# Altium schematic sheet Sheet3.SchDoc
size A4
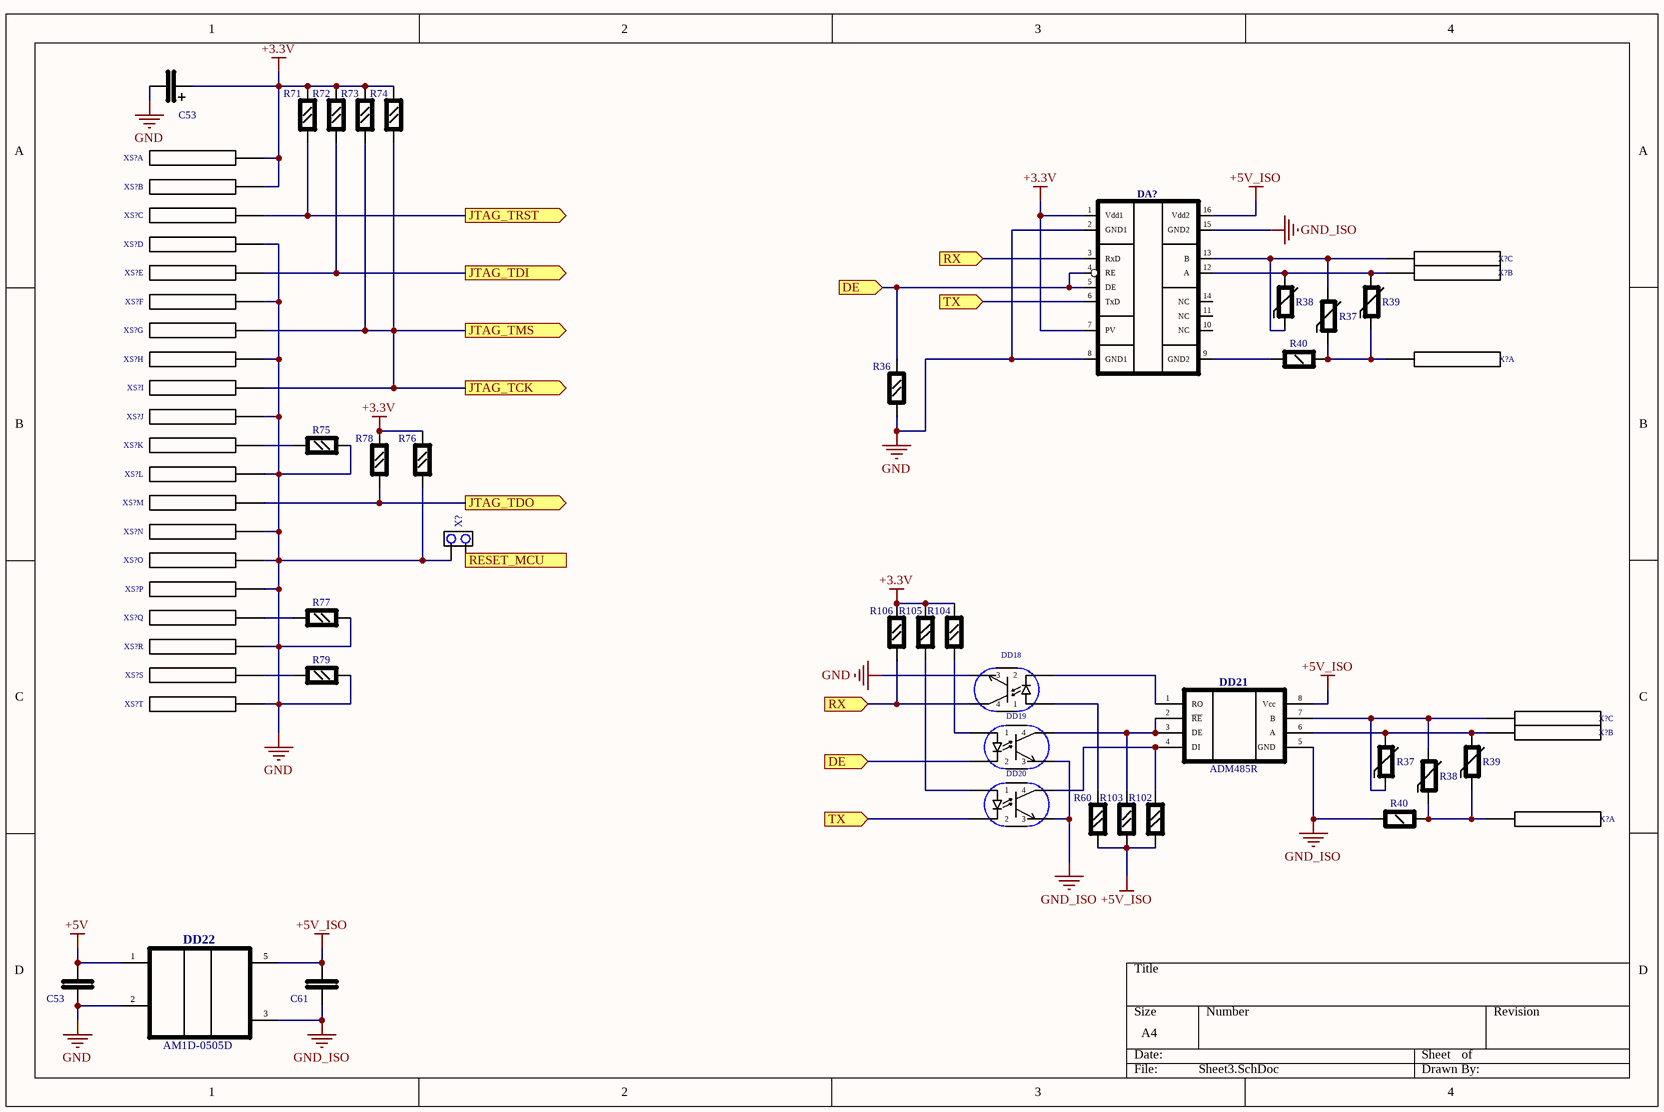
[diagram p0: Sheet3.SchDoc]

## Parts
(Parts that share a designator on the sheet are numbered #1, #2 ... from top to bottom, then left to right.)
C53#1  CAP10  [CAP10]  (value not drawn)
C53#2  C_GORIZONT  [CAPCHIP]  (value not drawn)
C61  C_GORIZONT  [CAPCHIP]  (value not drawn)
DA?  ADM2483  [SO16]  (value not drawn)
DD18  FODM2705  [FODM2705_FODM2705(Primary)]  (value not drawn)
DD19  FODM2705  [FODM2705_FODM2705(Primary)]  (value not drawn)
DD20  FODM2705  [FODM2705_FODM2705(Primary)]  (value not drawn)
DD21  ADM485R  [SO8]
DD22  AM1D-0505D  [P10CU-0512Z]
R36  RES_0805  [RES_0805]  (value not drawn)
R37#1  VARISTOR  [VARISTOR]  (value not drawn)
R37#2  VARISTOR  [VARISTOR]  (value not drawn)
R38#1  VARISTOR  [VARISTOR]  (value not drawn)
R38#2  VARISTOR  [VARISTOR]  (value not drawn)
R39#1  VARISTOR  [VARISTOR]  (value not drawn)
R39#2  VARISTOR  [VARISTOR]  (value not drawn)
R40#1  RES_1206  [RES_1206]  (value not drawn)
R40#2  RES_1206  [RES_1206]  (value not drawn)
R60  RES_0805  [RES_0805]  (value not drawn)
R71  RES_0805  [RES_0805]  (value not drawn)
R72  RES_0805  [RES_0805]  (value not drawn)
R73  RES_0805  [RES_0805]  (value not drawn)
R74  RES_0805  [RES_0805]  (value not drawn)
R75  RES_0805  [RES_0805]  (value not drawn)
R76  RES_0805  [RES_0805]  (value not drawn)
R77  RES_0805  [RES_0805]  (value not drawn)
R78  RES_0805  [RES_0805]  (value not drawn)
R79  RES_0805  [RES_0805]  (value not drawn)
R102  RES_0805  [RES_0805]  (value not drawn)
R103  RES_0805  [RES_0805]  (value not drawn)
R104  RES_0805  [RES_0805]  (value not drawn)
R105  RES_0805  [RES_0805]  (value not drawn)
R106  RES_0805  [RES_0805]  (value not drawn)
X?#1  DFK-MSTBA2.5/3-GF-5.08  [DFK_MSTBA3_ALL]  (value not drawn)  (part C of 3)
X?#2  DFK-MSTBA2.5/3-GF-5.08  [DFK_MSTBA3_ALL]  (value not drawn)  (part B of 3)
X?#3  DFK-MSTBA2.5/3-GF-5.08  [DFK_MSTBA3_ALL]  (value not drawn)  (part A of 3)
X?#4  JL2  [JL2]  (value not drawn)
X?#5  DFK-MSTBA2.5/3-GF-5.08  [DFK_MSTBA3_ALL]  (value not drawn)  (part C of 3)
X?#6  DFK-MSTBA2.5/3-GF-5.08  [DFK_MSTBA3_ALL]  (value not drawn)  (part B of 3)
X?#7  DFK-MSTBA2.5/3-GF-5.08  [DFK_MSTBA3_ALL]  (value not drawn)  (part A of 3)
XS?#1  BH20  [BH20]  (value not drawn)  (part A of 20)
XS?#2  BH20  [BH20]  (value not drawn)  (part B of 20)
XS?#3  BH20  [BH20]  (value not drawn)  (part C of 20)
XS?#4  BH20  [BH20]  (value not drawn)  (part D of 20)
XS?#5  BH20  [BH20]  (value not drawn)  (part E of 20)
XS?#6  BH20  [BH20]  (value not drawn)  (part F of 20)
XS?#7  BH20  [BH20]  (value not drawn)  (part G of 20)
XS?#8  BH20  [BH20]  (value not drawn)  (part H of 20)
XS?#9  BH20  [BH20]  (value not drawn)  (part I of 20)
XS?#10  BH20  [BH20]  (value not drawn)  (part J of 20)
XS?#11  BH20  [BH20]  (value not drawn)  (part K of 20)
XS?#12  BH20  [BH20]  (value not drawn)  (part L of 20)
XS?#13  BH20  [BH20]  (value not drawn)  (part M of 20)
XS?#14  BH20  [BH20]  (value not drawn)  (part N of 20)
XS?#15  BH20  [BH20]  (value not drawn)  (part O of 20)
XS?#16  BH20  [BH20]  (value not drawn)  (part P of 20)
XS?#17  BH20  [BH20]  (value not drawn)  (part Q of 20)
XS?#18  BH20  [BH20]  (value not drawn)  (part R of 20)
XS?#19  BH20  [BH20]  (value not drawn)  (part S of 20)
XS?#20  BH20  [BH20]  (value not drawn)  (part T of 20)

## Ports
DE (in), JTAG_TCK (out), JTAG_TDI (out), JTAG_TDO (out), JTAG_TMS (out), JTAG_TRST (out), RESET_MCU (out), RX (in), TX (in)

## Nets
+3.3V: C53#1.1(D1) DA?.1(Vdd1) DA?.7(PV) R71.2(D2) R72.2(D2) R73.2(D2) R74.2(D2) R76.2(D2) R78.2(D2) R104.2(D2) R105.2(D2) R106.2(D2) XS?#1.1 XS?#2.2
+5V: C53#2.1(D1) DD22.1(+5in)
+5V_ISO: C61.1(D1) DA?.16(Vdd2) DD21.8(Vcc) DD22.5(+12V) R60.1(D1) R102.1(D1) R103.1(D1)
GND: C53#1.2(D2) C53#2.2(D2) DA?.2(GND1) DA?.8(GND1) DD18.Emitter(3) DD22.2(-5in) R36.1(D1) R75.2(D2) R76.1(D1) R77.2(D2) R79.2(D2) X?#4.2 XS?#4.4 XS?#6.6 XS?#8.8 XS?#10.10 XS?#12.12 XS?#14.14 XS?#15.15 XS?#16.16 XS?#18.18 XS?#20.20
GND_ISO: C61.2(D2) DA?.15(GND2) DD19.Emitter(3) DD20.Emitter(3) DD21.5(GND) DD22.3(-12V) R40#2.1(D1)
DE: DA?.4(RE) DA?.5(DE) DD19.Cathod(2) R36.2(D2) ; port DE
JTAG_TCK: R73.1(D1) R74.1(D1) XS?#7.7 XS?#9.9 ; port JTAG_TMS, port JTAG_TCK
JTAG_TDI: R72.1(D1) XS?#5.5 ; port JTAG_TDI
JTAG_TDO: R78.1(D1) XS?#13.13 ; port JTAG_TDO
JTAG_TRST: R71.1(D1) XS?#3.3 ; port JTAG_TRST
RESET_MCU: X?#4.1 ; port RESET_MCU
RX: DA?.3(RxD) DD18.Collector(4) R106.1(D1) ; port RX
TX: DA?.6(TxD) DD20.Cathod(2) ; port TX
NetDA?_9: DA?.9(GND2) R40#1.1(D1)
NetDA?_12: DA?.12(A) R38#1.2(D2) R39#1.2(D2) X?#2.2
NetDA?_13: DA?.13(B) R37#1.2(D2) R38#1.1(D1) X?#1.3
NetDD18_Anod: DD18.Anod(1) R60.2(D2)
NetDD18_Cathod: DD18.Cathod(2) DD21.1(RO)
NetDD19_Anod: DD19.Anod(1) R104.1(D1)
NetDD19_Collector: DD19.Collector(4) DD21.2(~{RE}) DD21.3(DE) R103.2(D2)
NetDD20_Anod: DD20.Anod(1) R105.1(D1)
NetDD20_Collector: DD20.Collector(4) DD21.4(DI) R102.2(D2)
NetDD21_6: DD21.6(A) R37#2.2(D2) R39#2.2(D2) X?#6.2
NetDD21_7: DD21.7(B) R37#2.1(D1) R38#2.2(D2) X?#5.3
NetR37#1_1: R37#1.1(D1) R39#1.1(D1) R40#1.2(D2) X?#3.1
NetR38#2_1: R38#2.1(D1) R39#2.1(D1) R40#2.2(D2) X?#7.1
NetR75_1: R75.1(D1) XS?#11.11
NetR77_1: R77.1(D1) XS?#17.17
NetR79_1: R79.1(D1) XS?#19.19

Not connected (* = marked no-connect by the designer): DA? 10(NC) 11(NC) 14(NC); X?#1 4 5; X?#2 4 5; X?#3 4 5; X?#5 4 5; X?#6 4 5; X?#7 4 5

## Library data of the parts
DD22 = AM1D-0512D: Value: *
C53#1 = CAP10: Value: *
C53#2 C61 = C_GORIZONT: Value: *
DA? = ADM2483: Value: *
DD18-DD20 = FODM2705: Value: *
DD21 = ADM485R: Value: *
R36 R60 R71-R79 R102-R106 = RES_0805: Value: *
R37#1 R37#2 R38#1 R38#2 R39#1 R39#2 = VARISTOR: Value: *
R40#1 R40#2 = RES_1206: Value: *
X?#1-X?#3 X?#5-X?#7 = DFK-MSTBA2.5/3-GF-5.08: Value: *
X?#4 = JL2: Value: *
XS?#1-XS?#20 = BH20: Value: *